# EAGLE design USB2SPI (EAGLE 9.6.2)
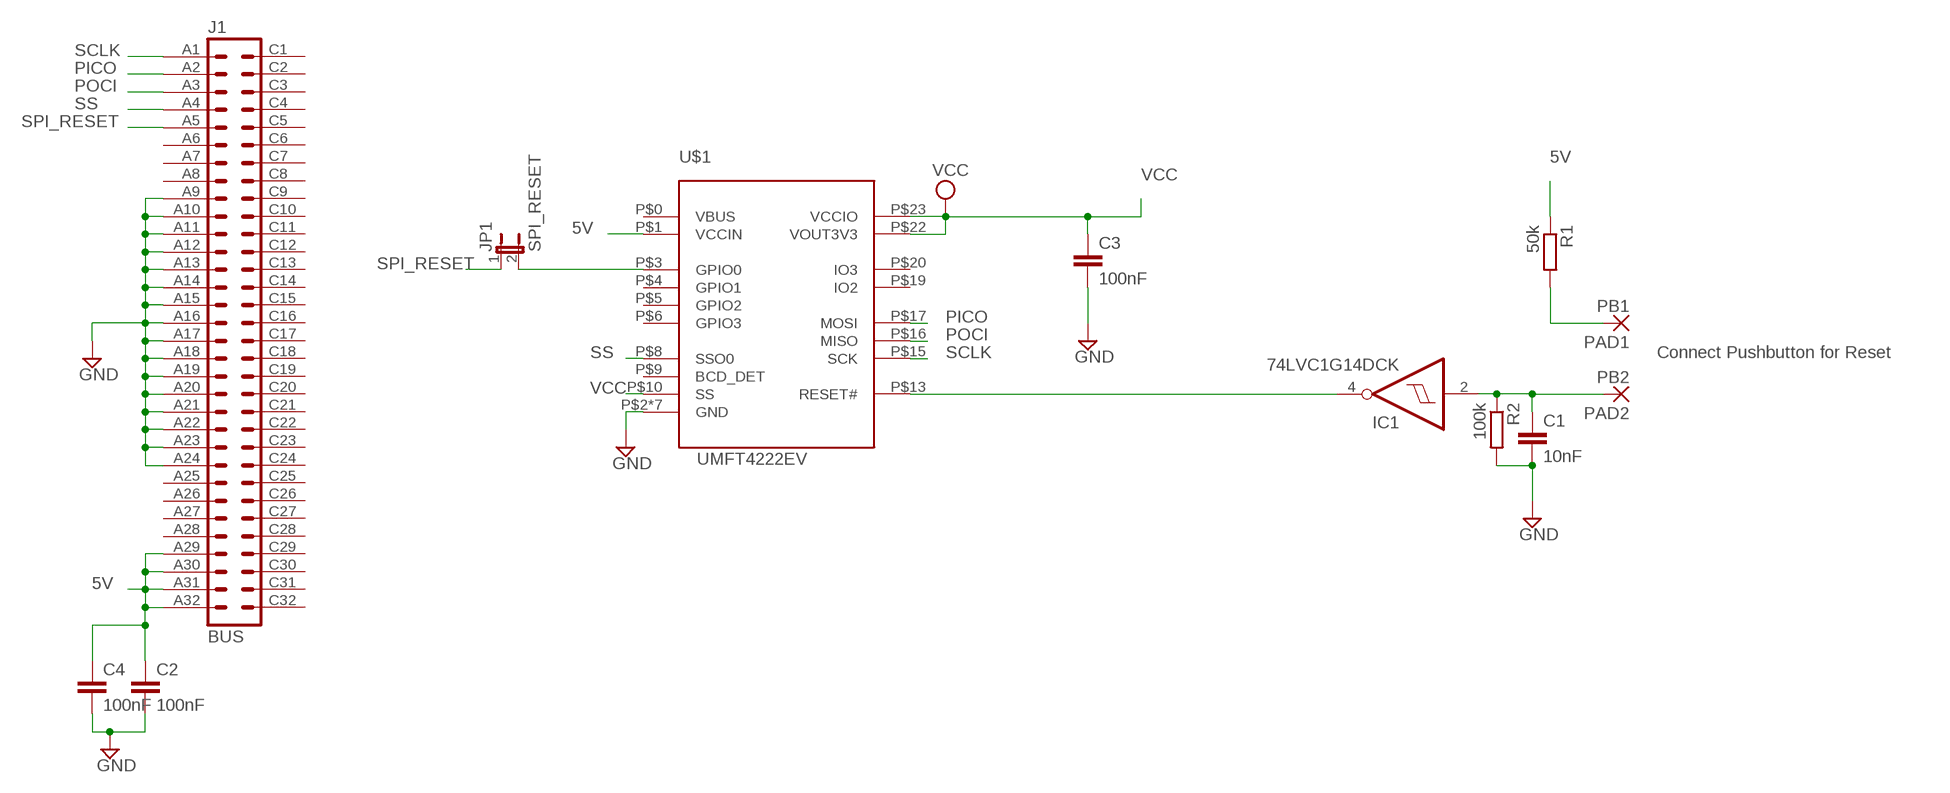
[diagram p0: schematic, sheet 1]

## Parts
C1  10nF  C-EUC0603  [C0603]
C2  100nF  C-EUC0603  [C0603]
C3  100nF  C-EUC0603  [C0603]
C4  100nF  C-EUC0603  [C0603]
IC1  74LVC1G14DCK  [SC70-5]
J1  BUS  VG64P  [VG64P]
JP1  SPI_RESET  JP1E  [JP1]
PAD1  PB1  SMD5  [SMD2,54-5,08]
PAD2  PB2  SMD5  [SMD2,54-5,08]
R1  50k  R-EU_R0603  [R0603]
R2  100k  R-EU_R0603  [R0603]
U$1  UMFT4222EV  [UMFT4222EV]

## Nets
5V: C2.1 C4.1 J1.A29 J1.A30 J1.A31 J1.A32 R1.1 U$1.P$1(VCCIN)
GND: C1.2 C2.2 C3.2 C4.2 J1.A9 J1.A10 J1.A11 J1.A12 J1.A13 J1.A14 J1.A15 J1.A16 J1.A17 J1.A18 J1.A19 J1.A20 J1.A21 J1.A22 J1.A23 J1.A24 R2.2 U$1.P$2(GND) U$1.P$7(GND) U$1.P$11(GND) U$1.P$12(GND) U$1.P$14(GND) U$1.P$18(GND) U$1.P$21(GND)
N$1: JP1.2 U$1.P$3(GPIO0)
N$2: IC1.4(O) U$1.P$13(RESET#)
N$4: C1.1 IC1.2(I) PAD2.1(P) R2.1
N$5: PAD1.1(P) R1.2
PICO: J1.A2 U$1.P$17(MOSI)
POCI: J1.A3 U$1.P$16(MISO)
SCLK: J1.A1 U$1.P$15(SCK)
SPI_RESET: J1.A5 JP1.1
SS: J1.A4 U$1.P$8(SSO0)
VCC: C3.1 U$1.P$10(SS) U$1.P$22(VOUT3V3) U$1.P$23(VCCIO)
Unconnected: J1.A6 J1.A7 J1.A8 J1.A25 J1.A26 J1.A27 J1.A28 J1.C1 J1.C2 J1.C3 J1.C4 J1.C5 J1.C6 J1.C7 J1.C8 J1.C9 J1.C10 J1.C11 J1.C12 J1.C13 J1.C14 J1.C15 J1.C16 J1.C17 J1.C18 J1.C19 J1.C20 J1.C21 J1.C22 J1.C23 J1.C24 J1.C25 J1.C26 J1.C27 J1.C28 J1.C29 J1.C30 J1.C31 J1.C32 U$1.P$0(VBUS) U$1.P$4(GPIO1) U$1.P$5(GPIO2) U$1.P$6(GPIO3) U$1.P$9(BCD_DET) U$1.P$19(IO2) U$1.P$20(IO3)

## Notes on the sheet
- Connect Pushbutton for Reset

## Power pins joined to a net without a drawn wire
GND: IC1.3(GND)
VCC: IC1.5(VCC)

## Library data of the parts
C1-C4 = rcl:C-EU: CAPACITOR, European symbol; SPICEPREFIX: C
IC1 = 74xx-little-us:74*1G14: Single Schmitt-Trigger Inverter Gate
J1 = 19inch:VG64: PCB EUROCARD, 64-pin type C/AC, 2.54 mm
JP1 = jumper:JP1E: JUMPER
PAD1 PAD2 = wirepad:SMD5: SMD PAD
R1 R2 = rcl:R-EU_: RESISTOR, European symbol; SPICEPREFIX: R
U$1 = Orzada:UMFT4222EV

## Board
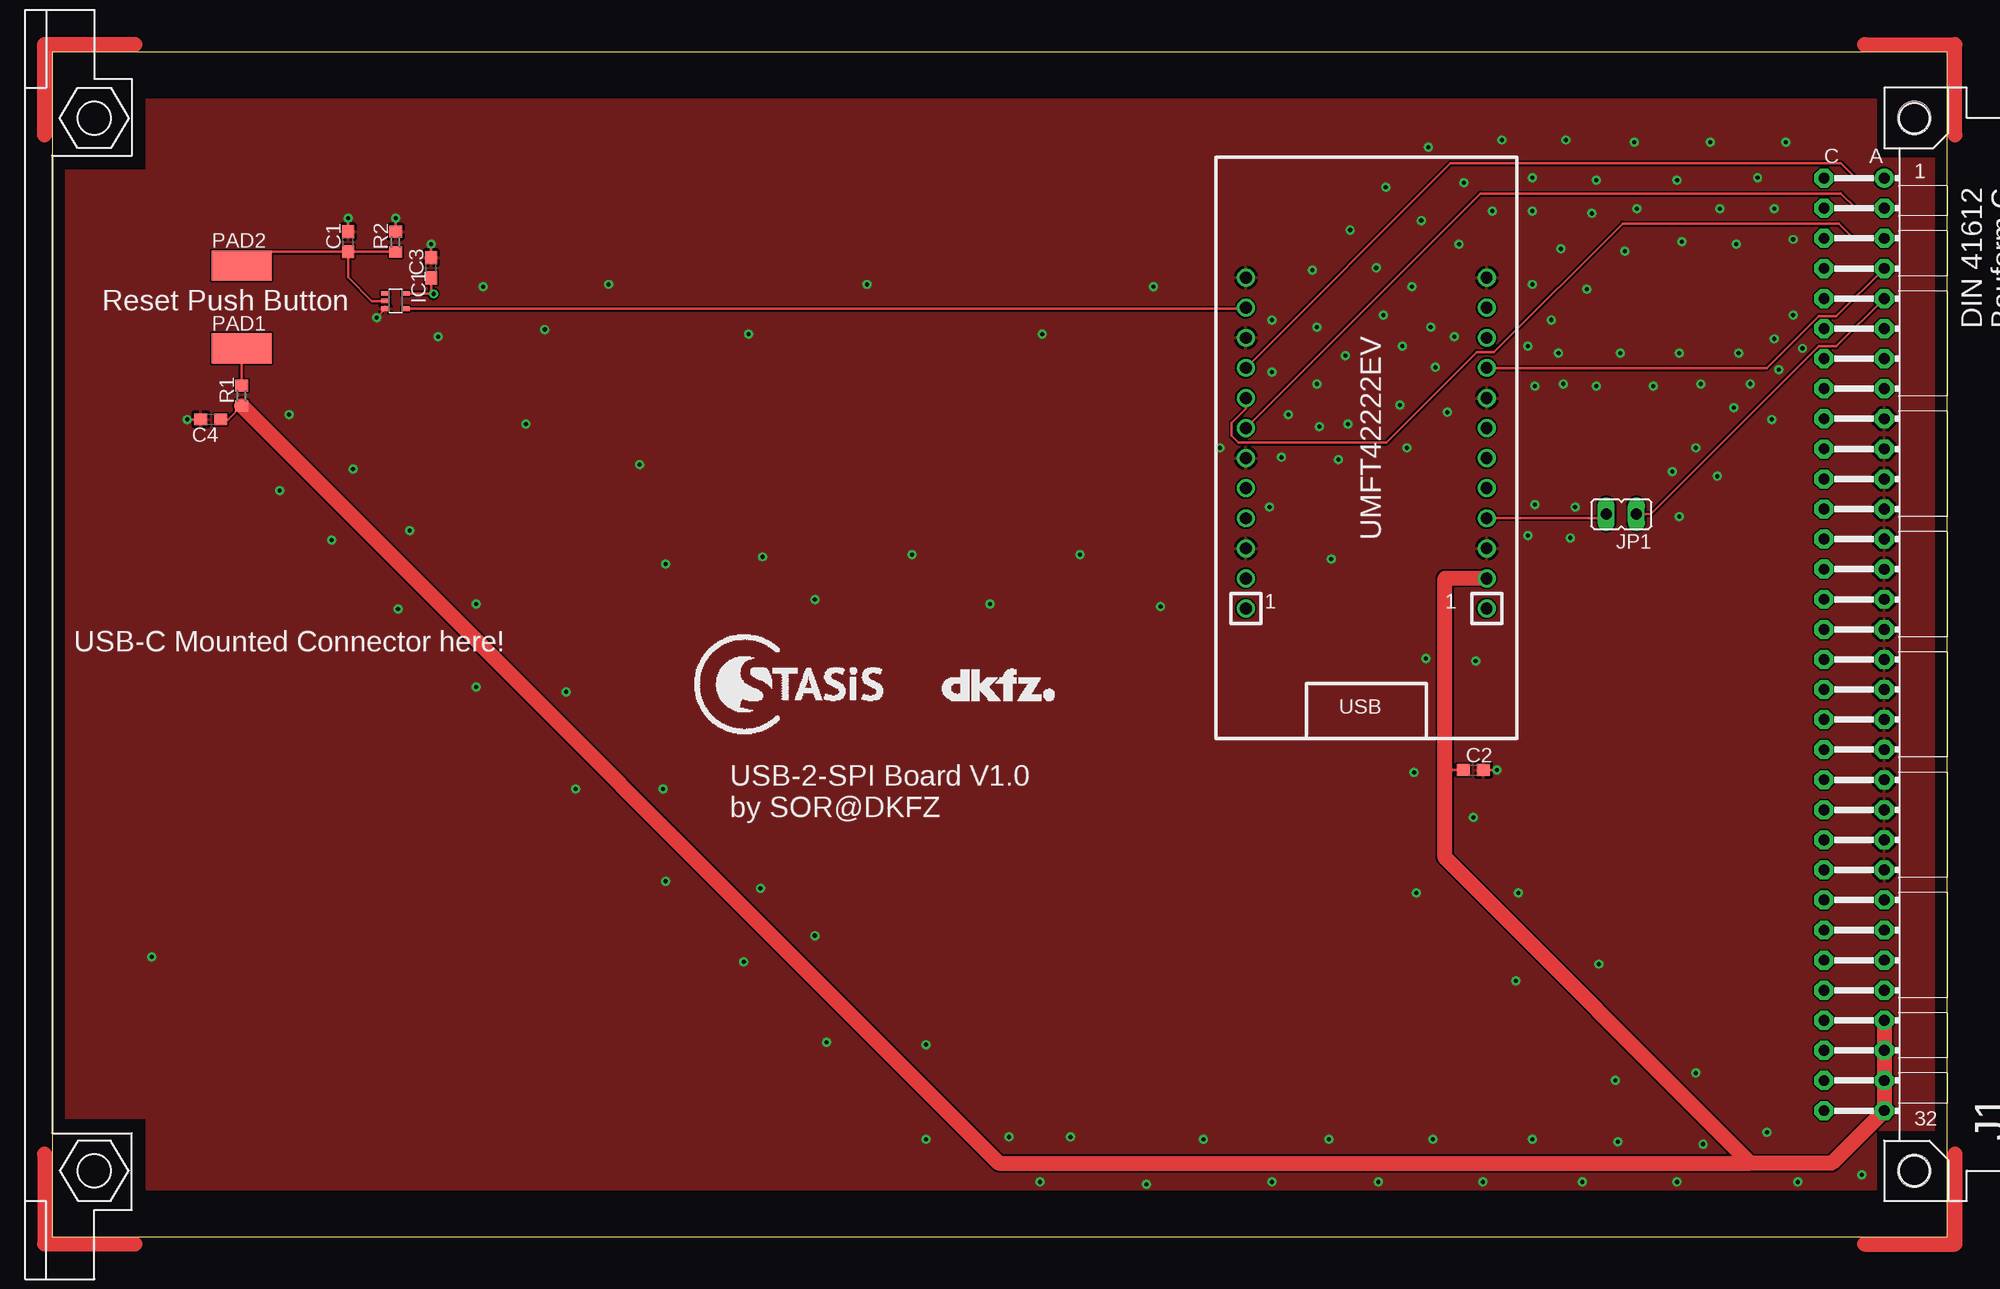
[diagram p1: board, top side]
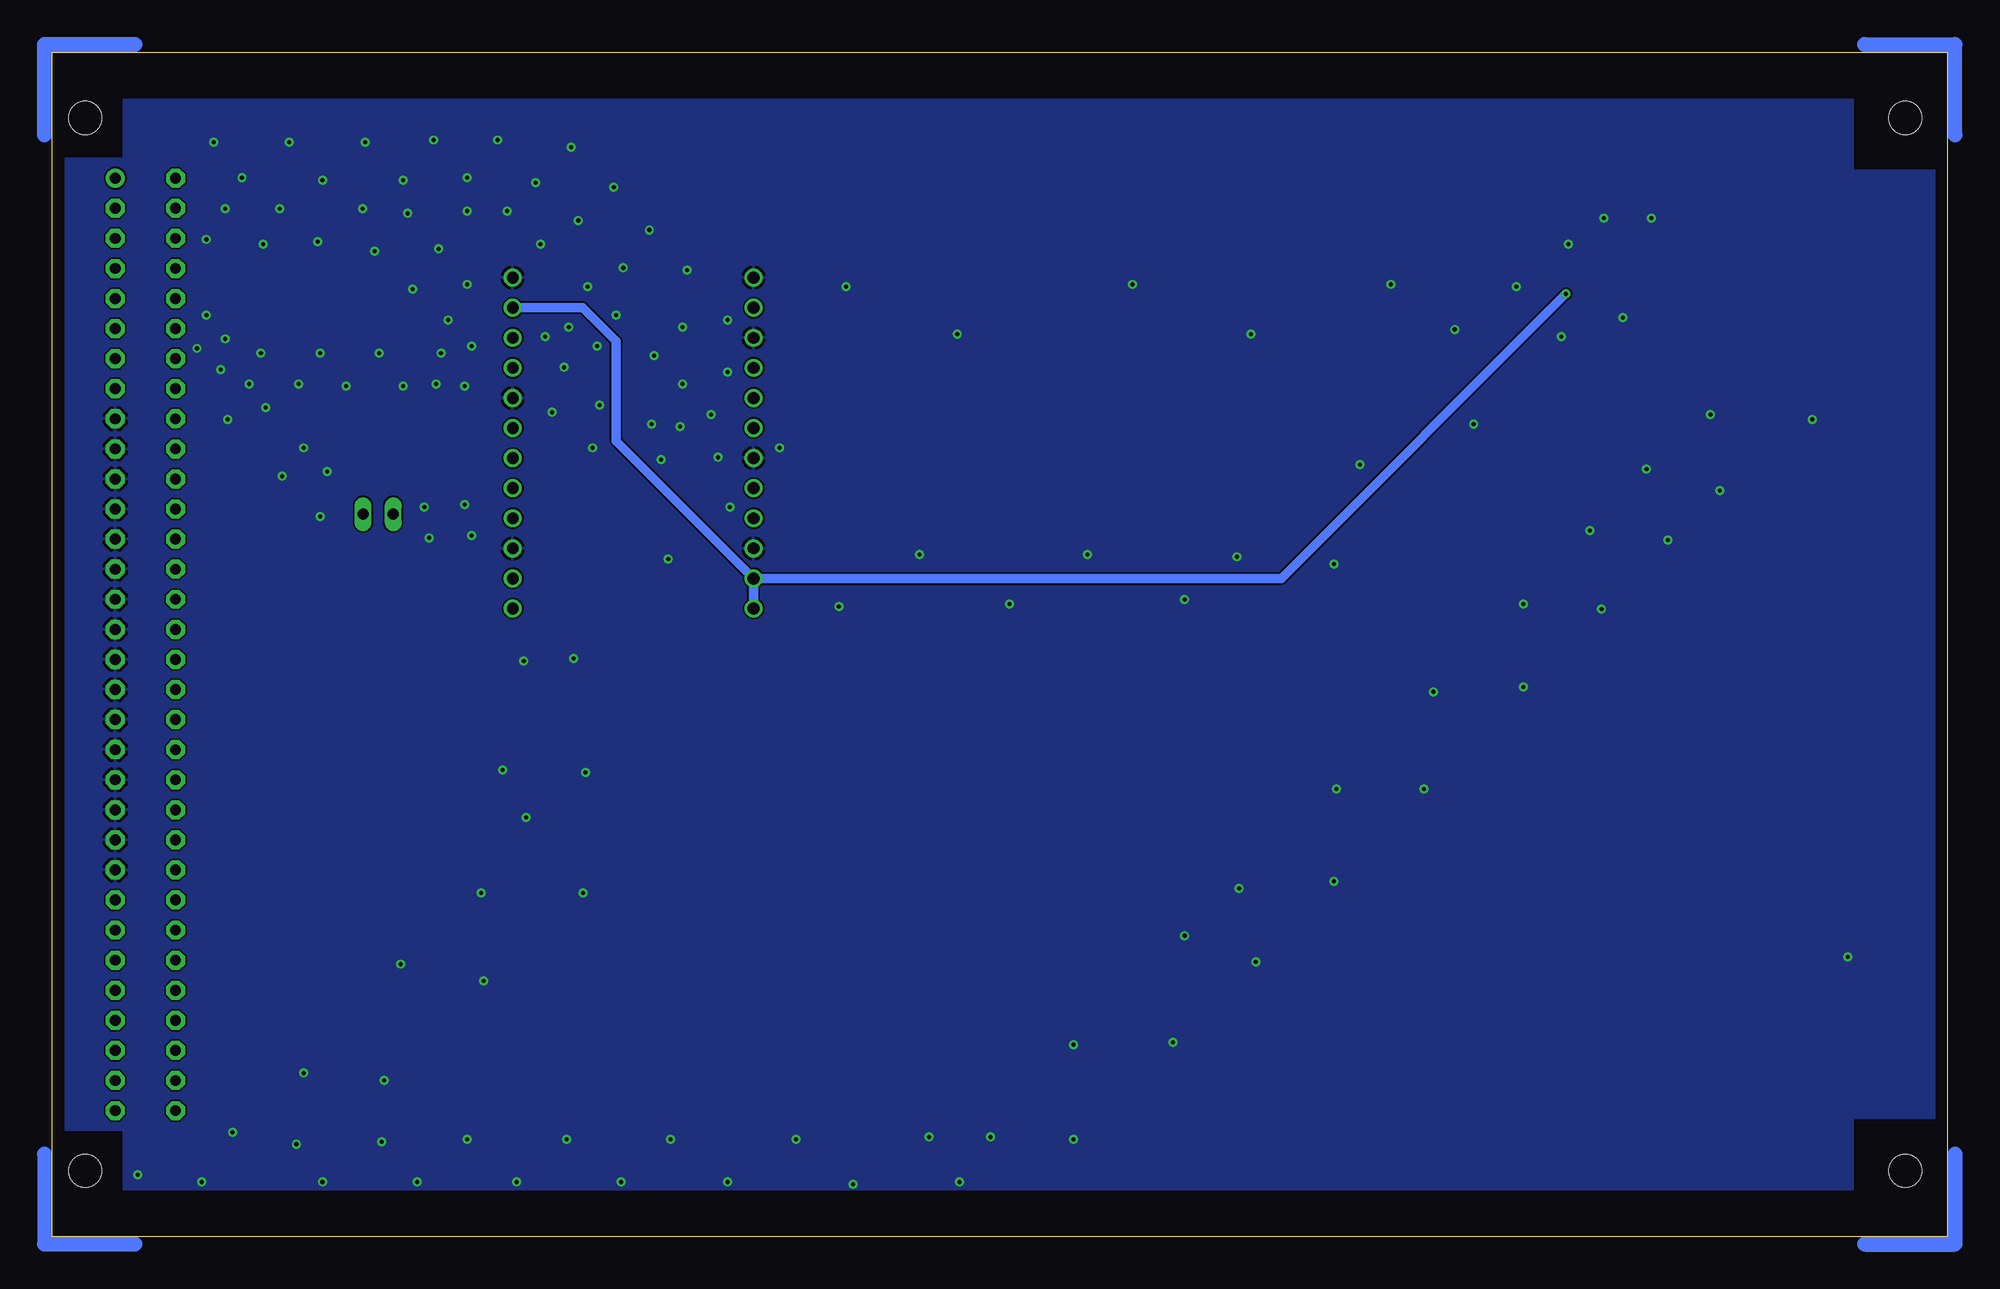
[diagram p2: board, bottom side, seen from below]

Size 160.02 x 100.03 mm. Coordinates in mm from the lower left corner, seen from the top.
Copper layers (1*16): Top 0.035mm / dielectric 1.5mm / Bottom 0.035mm
Design rules "default": minimum track width 6mil, minimum drill 0.35mm, track to track 6mil, track to pad 6mil, pad to pad 6mil, via to via 6mil, smd to smd 6mil, copper to edge 40mil, drill to drill 6mil, minimum pad ring 10mil, minimum via ring 8mil, stop-mask expansion 4mil, vias tented up to drill 0mil, thermal gap 10mil

### Footprints (pad centres in the part's own frame; a part is rotated, then mirrored left to right if it is on the bottom)
C0603 = smd 1.1 x 1: 1 -0.85,0; 2 0.85,0
SC70-5 = smd 0.4 x 0.7: 1 -0.65,-0.85; 2 0,-0.85; 3 0.65,-0.85; 4 0.65,0.85; 5 -0.65,0.85
VG64P = drill 0.914 pad 1.6: A1 154.94,39.37 | drill 0.914 pad 1.6 octagon: A2 154.94,36.83; A3 154.94,34.29; A4 154.94,31.75; A5 154.94,29.21; A6 154.94,26.67; A7 154.94,24.13; A8 154.94,21.59; A9 154.94,19.05; A10 154.94,16.51; A11 154.94,13.97; A12 154.94,11.43; A13 154.94,8.89; A14 154.94,6.35; A15 154.94,3.81; A16 154.94,1.27; A17 154.94,-1.27; A18 154.94,-3.81; A19 154.94,-6.35; A20 154.94,-8.89; A21 154.94,-11.43; A22 154.94,-13.97; A23 154.94,-16.51; A24 154.94,-19.05; A25 154.94,-21.59; A26 154.94,-24.13; A27 154.94,-26.67; A28 154.94,-29.21; A29 154.94,-31.75; A30 154.94,-34.29; A31 154.94,-36.83; A32 154.94,-39.37; C1 149.86,39.37; C2 149.86,36.83; C3 149.86,34.29; C4 149.86,31.75; C5 149.86,29.21; C6 149.86,26.67; C7 149.86,24.13; C8 149.86,21.59; C9 149.86,19.05; C10 149.86,16.51; C11 149.86,13.97; C12 149.86,11.43; C13 149.86,8.89; C14 149.86,6.35; C15 149.86,3.81; C16 149.86,1.27; C17 149.86,-1.27; C18 149.86,-3.81; C19 149.86,-6.35; C20 149.86,-8.89; C21 149.86,-11.43; C22 149.86,-13.97; C23 149.86,-16.51; C24 149.86,-19.05; C25 149.86,-21.59; C26 149.86,-24.13; C27 149.86,-26.67; C28 149.86,-29.21; C29 149.86,-31.75; C30 149.86,-34.29; C31 149.86,-36.83; C32 149.86,-39.37 | hole 2.794: 3.81,44.45; 3.81,-44.45; 157.48,44.45; 157.48,-44.45
JP1 = drill 0.914 long: 1 0,-1.27; 2 0,1.27
SMD2,54-5,08 = smd 2.54 x 5.08: 1 0,0
R0603 = smd 1 x 1.1: 1 -0.85,0; 2 0.85,0
UMFT4222EV = drill 1: P$0 -10.16,13.97; P$1 -10.16,11.43; P$2 -10.16,8.89; P$3 -10.16,6.35; P$4 -10.16,3.81; P$5 -10.16,1.27; P$6 -10.16,-1.27; P$7 -10.16,-3.81; P$8 -10.16,-6.35; P$9 -10.16,-8.89; P$10 -10.16,-11.43; P$11 -10.16,-13.97; P$12 10.18,-13.97; P$13 10.18,-11.43; P$14 10.18,-8.89; P$15 10.18,-6.35; P$16 10.18,-3.81; P$17 10.18,-1.27; P$18 10.18,1.27; P$19 10.18,3.81; P$20 10.18,6.35; P$21 10.18,8.89; P$22 10.18,11.43; P$23 10.18,13.97

### Placement (x,y rotation side)
C1  25,84.01 90 top
C2  120,39.41 0 top
C3  32,81.81 90 top
C4  13.4,69.01 180 top
IC1  29,79.01 270 top
J1  -0.25,50.01 0 top
JP1  132.5,61.01 90 top
PAD1  16,75.01 270 top
PAD2  16,82.01 270 top
R1  16,71.01 90 top
R2  29,84.01 90 top
U$1  110.97,67.01 180 top
U$2  [LOGO_STASIS]  63.2,46.41 0 top
U$3  [LOGO_DKFZ]  75.2,45.21 0 top

### Tracks (layer width: path | path; a pad name or v marks a point on that pad's centre or on a via)
5V
  Top 0.2: R1.1 14.85,69.01 C4.1 | C2.1 117.6,39.41
  Top 1.27: J1.A29 J1.A30 J1.A31 J1.A32 150.26,6.21 143.4,6.21 | 143.4,6.21 117.6,32.01 117.6,39.41 117.6,55.61 121.1,55.61 U$1.P$1 | R1.1 79.95,6.21 143.4,6.21
GND  (via drill 0.35)
  Top 0.2: C1.2 v25,86.01 | R2.2 v29,86.01 | IC1.3 v27.4,77.61 | C3.2 v32,83.81 | C2.2 v122,39.41 | C4.2 v11.4,69.01
  other vias: 103,73.01 106.8,76.81 111.8,81.81 115.6,85.81 119.2,89.01 125,89.41 130.4,89.21 137.2,89.21 144,89.41 145.4,86.81 140.8,86.81 133.8,86.81 130,86.41 127.4,83.41 125,80.41 125,86.61 121.6,86.61 118.8,83.81 114.8,80.21 112.4,77.81 109.2,74.41 106.8,72.01 104.4,69.41 107,68.41 109.4,68.61 113.8,70.21 116.8,73.41 118.4,76.01 116.4,76.81 114,75.21 117.8,69.61 114.4,66.61 108.6,65.61 103.8,65.81 98.6,66.61 103,77.41 106.4,81.61 109.6,85.01 112.6,88.61 116.2,92.01 122.4,92.61 127.8,92.61 133.6,92.41 140,92.41 146.4,92.41 147,84.21 142.2,83.81 137.6,84.01 132.8,83.21 129.6,80.01 126.6,77.41 124.6,75.21 127.2,74.61 132.4,74.61 137.4,74.61 142.4,74.61 145.4,75.81 147,77.81 147.8,75.01 145.8,73.21 143.4,72.01 139.2,72.01 135.2,71.81 130.4,71.81 127.6,72.01 125.2,71.81 142,70.01 138.8,66.61 136.8,64.61 137.4,60.81 140.6,64.21 145.2,69.01 128.2,59.01 125.2,61.81 128.6,61.61 124.6,59.21 108,57.21 102.8,61.61 120.2,48.61 116,48.81 115,39.21 120,35.41 115.2,29.01 123.8,29.01 123.6,21.61 130.6,23.01 132,13.21 138.8,13.81 144.8,8.81 139.4,7.81 132.2,8.01 125,8.21 116.6,8.21 107.8,8.21 97.2,8.21 86,8.41 80.8,8.41 73.8,16.21 64.4,25.41 59.8,29.41 51.6,37.81 43.4,46.01 35.8,53.41 30.2,59.61 25.4,64.81 20,69.41 19.2,63.01 23.6,58.81 29.2,53.01 35.8,46.41 44.2,37.81 51.8,30.01 58.4,23.21 65.4,16.41 73.8,8.21 83.4,4.61 92.4,4.41 103,4.61 112,4.61 120.8,4.61 129.2,4.61 137.2,4.61 147.4,4.61 152.8,5.21 93,80.21 68.8,80.41 47,80.41 36.4,80.21 41.6,76.61 58.8,76.21 83.6,76.21 32.6,76.01 40,68.61 49.6,65.21 51.8,56.81 60,57.41 64.4,53.81 72.6,57.61 79.2,53.41 86.8,57.61 93.6,53.21 8.4,23.61
  pour Bottom: 8,96.01 8,90.01 1,90.01 1,10.01 8,10.01 8,4.01 154,4.01 154,8.01 154,9.01 159,9.01 159,91.01 154,91.01 154,96.01
  pour Top: 8,96.01 8,90.01 1,90.01 1,10.01 8,10.01 8,4.01 154,4.01 154,9.01 159,9.01 159,91.01 154,91.01 154,96.01
N$1
  Top 0.2: U$1.P$3 130.88,60.66 JP1.2
N$2
  Top 0.2: IC1.4 100.71,78.36 U$1.P$13
N$4
  Top 0.2: PAD2.1 17.15,83.16 C1.1 | C1.1 R2.1 | C1.1 25,81.01 27,79.01 IC1.2
N$5
  Top 0.2: R1.2 PAD1.1
PICO
  Top 0.2: J1.A2 152.29,86.84 151.04,88.09 120.6,88.09 U$1.P$17
POCI
  Top 0.2: U$1.P$16 100.79,69.91 99.58,68.7 99.58,67.67 100.17,67.08 112.66,67.08 120.28,74.7 121.74,74.7 132.6,85.56 150.84,85.56 152.09,84.3 J1.A3
SCLK
  Top 0.2: J1.A1 152.29,89.38 151.04,90.64 118.06,90.64 U$1.P$15
SPI_RESET
  Top 0.2: J1.A5 150.66,75.2 149.17,75.2 134.99,61.01 JP1.1
SS
  Top 0.2: J1.A4 150.66,77.73 149.17,77.73 144.8,73.36 U$1.P$8
VCC  (via drill 0.35)
  Top 0.2: IC1.5 29.9,79.61 v32.2,79.61 32,79.81 C3.1
  Bottom 0.813: U$1.P$23 U$1.P$22 | U$1.P$22 112.4,67.19 112.4,75.61 115.23,78.44 U$1.P$10 | U$1.P$22 56.23,55.58 v32.2,79.61

### Text on the board
tPlace: Reset Push Button | UMFT42222EV | USB-C Mounted Connector here! | USB-2-SPI Board V1.0 / by SOR@DKFZ